# EAGLE design proxy (EAGLE 4.13)
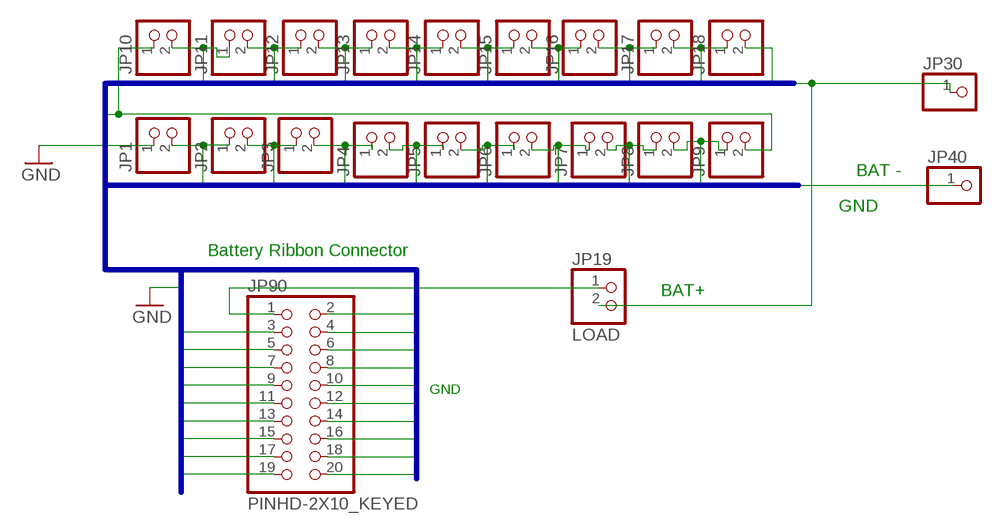
[diagram p0: schematic, sheet 1]

## Parts
JP1  PINHD-1X2  [1X02]
JP2  PINHD-1X2  [1X02]
JP3  PINHD-1X2  [1X02]
JP4  PINHD-1X2  [1X02]
JP5  PINHD-1X2  [1X02]
JP6  PINHD-1X2  [1X02]
JP7  PINHD-1X2  [1X02]
JP8  PINHD-1X2  [1X02]
JP9  PINHD-1X2  [1X02]
JP10  PINHD-1X2  [1X02]
JP11  PINHD-1X2  [1X02]
JP12  PINHD-1X2  [1X02]
JP13  PINHD-1X2  [1X02]
JP14  PINHD-1X2  [1X02]
JP15  PINHD-1X2  [1X02]
JP16  PINHD-1X2  [1X02]
JP17  PINHD-1X2  [1X02]
JP18  PINHD-1X2  [1X02]
JP19  LOAD  PINHD-1X2  [1X02]
JP30  PINHD-1X1  [1X01]
JP40  PINHD-1X1  [1X01]
JP90  PINHD-2X10_KEYED  [2X10_KEYED]

## Nets
CH1: JP1.2 JP2.1 JP90.12
CH2: JP2.2 JP3.1 JP90.3
CH3: JP3.2 JP4.1 JP90.13
CH4: JP4.2 JP5.1 JP90.4
CH5: JP5.2 JP6.1 JP90.14
CH6: JP6.2 JP7.1 JP90.5
CH7: JP7.2 JP8.1 JP90.15
CH8: JP8.2 JP9.1 JP90.6
CH9: JP9.2 JP10.1 JP90.16
CH10: JP10.2 JP11.1 JP90.7
CH11: JP11.2 JP12.1 JP90.17
CH12: JP12.2 JP13.1 JP90.8
CH13: JP13.2 JP14.1 JP90.18
CH14: JP14.2 JP15.1 JP90.9
CH15: JP15.2 JP16.1 JP90.19
CH16: JP16.2 JP17.1 JP90.10
CH17: JP17.2 JP18.1 JP90.20
CH18: JP18.2 JP19.2 JP30.1 JP90.11
CUR-SENSE: JP19.1 JP90.1
GND: JP1.1 JP40.1 JP90.2

## Buses
HDR$:GND,CH[0..18]

## Notes on the sheet
- BAT -
- GND
- Battery Ribbon Connector
- BAT+
- GND

## Library data of the parts
JP1-JP19 = pinhead:PINHD-1X2: PIN HEADER
JP30 JP40 = pinhead:PINHD-1X1: PIN HEADER
JP90 = pinhead:PINHD-2X10_KEYED

## Board
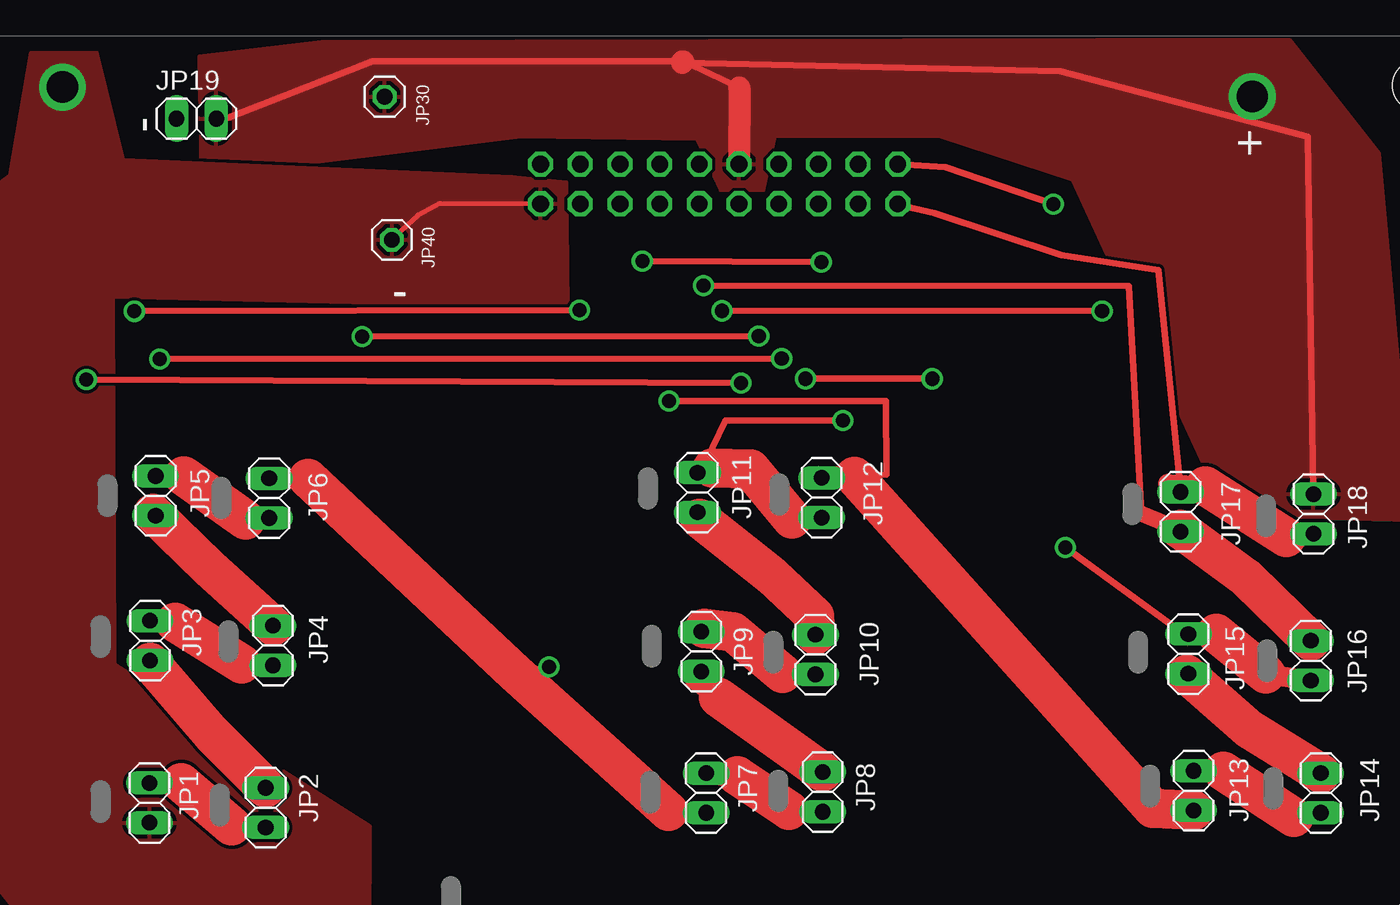
[diagram p1: board, top side]
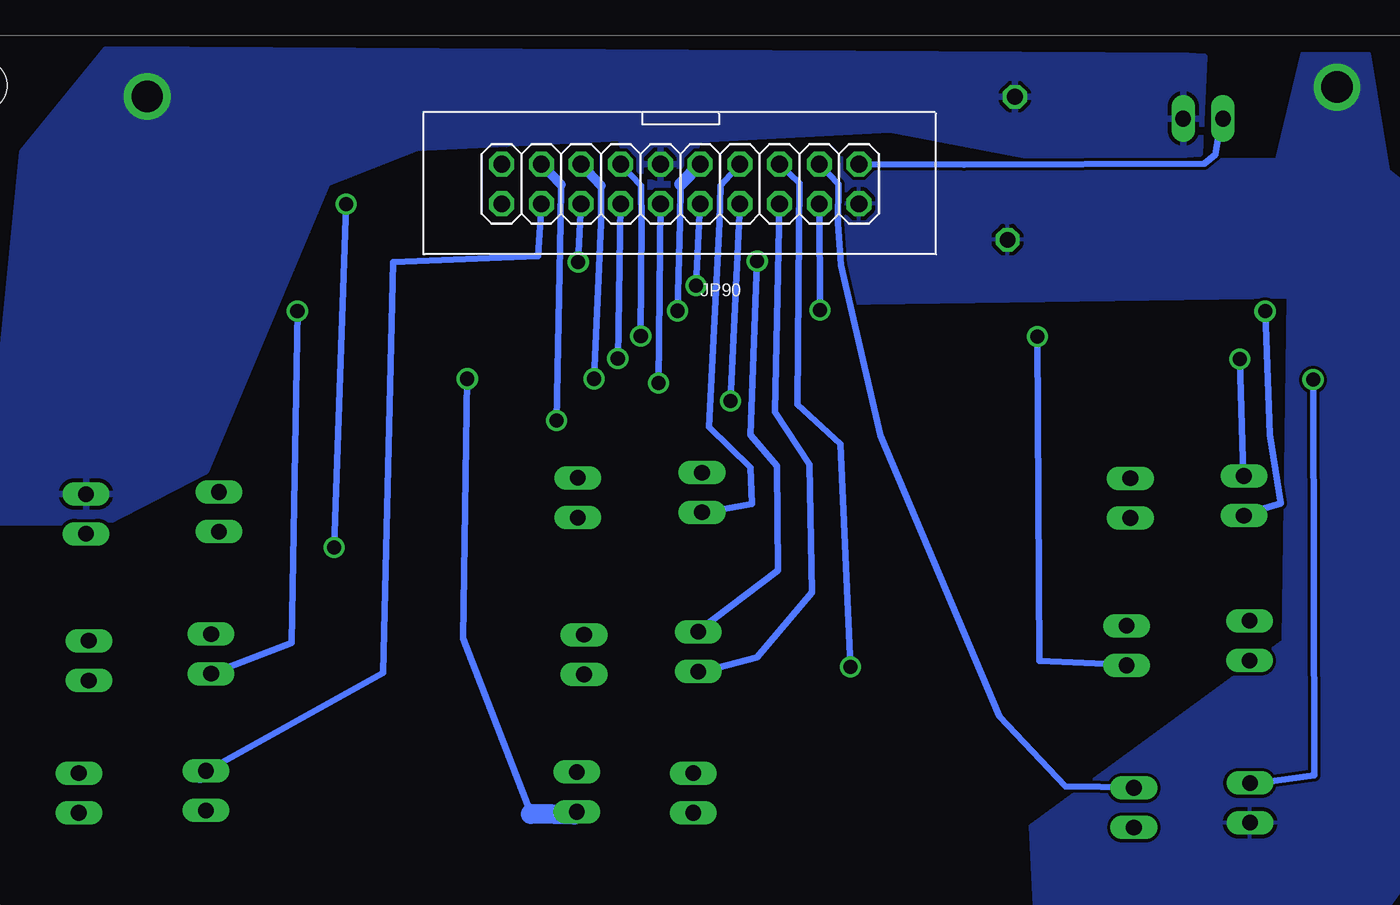
[diagram p2: board, bottom side, seen from below]

No outline drawn. Coordinates in mm, seen from the top.
Copper layers (1*16): Top 0.035mm / dielectric 1.5mm / Bottom 0.035mm
Design rules "default": minimum track width 8mil, minimum drill 0.6mm, track to track 8mil, track to pad 8mil, pad to pad 8mil, via to via 8mil, smd to smd 0mil, copper to edge 8mil, drill to drill 8mil, minimum pad ring 10mil, minimum via ring 8mil, stop-mask expansion 4mil, vias tented up to drill 0mil, thermal gap 10mil
Holes 3.2 mm at 3.2,3.2 3.2,56.8 96.8,56.8 96.8,3.2

### Footprints (pad centres in the part's own frame; a part is rotated, then mirrored left to right if it is on the bottom)
1X02 = drill 1 long: 1 -1.27,0; 2 1.27,0
1X01 = drill 1 octagon: 1 0,0
2X10_KEYED = drill 1.067 octagon: 1 -11.46,-1.27; 2 -11.46,1.27; 3 -8.92,-1.27; 4 -8.92,1.27; 5 -6.38,-1.27; 6 -6.38,1.27; 7 -3.84,-1.27; 8 -3.84,1.27; 9 -1.3,-1.27; 10 -1.3,1.27; 11 1.24,-1.27; 12 1.24,1.27; 13 3.78,-1.27; 14 3.78,1.27; 15 6.32,-1.27; 16 6.32,1.27; 17 8.86,-1.27; 18 8.86,1.27; 19 11.4,-1.27; 20 11.4,1.27

### Placement (x,y rotation side)
JP1  15.68,10.89 90 top
JP2  23.11,10.58 90 top
JP3  15.71,21.27 90 top
JP4  23.58,20.96 90 top
JP5  16.07,30.54 90 top
JP6  23.33,30.39 90 top
JP7  51.29,11.52 90 top
JP8  58.75,11.59 90 top
JP9  50.99,20.57 90 top
JP10  58.29,20.38 90 top
JP11  50.74,30.75 90 top
JP12  58.69,30.42 90 top
JP13  82.49,11.67 90 top
JP14  90.62,11.52 90 top
JP15  82.15,20.42 90 top
JP16  89.98,19.99 90 top
JP17  81.66,29.52 90 top
JP18  90.15,29.38 90 top
JP19  18.68,54.68 0 top
JP30  30.72,56.08 180 top
JP40  31.19,46.93 180 top
JP90  52.16,50.5 180 bottom

### Tracks (layer width: path | path; a pad name or v marks a point on that pad's centre or on a via)
CH1  (via drill 0.9)
  Top 0.406: v11.64,37.98 v53.53,37.77
  Top 0.813: JP1.2 15.66,12.13
  Top 1.27: 20.94,9.42 JP2.1 | 15.66,12.13 17.71,12.18
  Top 2.54: 17.71,12.18 20.94,9.42
  Bottom 0.406: v53.53,37.77 JP90.12 | v11.64,37.98 11.57,12.64 15.76,12.08 JP1.2
CH2
  Top 0.813: JP3.1 15.71,19.87
  Top 2.54: JP2.2 19.67,15.3 15.71,19.87
  Bottom 0.406: JP90.3 42.01,50.49 42.04,47.99 41.84,45.32 39.33,34.4 31.71,16.43 27.5,11.95 23.01,11.88 JP2.2
CH3  (via drill 0.9)
  Top 0.406: v29.28,40.72 v54.66,40.76
  Top 0.813: JP3.2 15.48,22.44
  Top 1.27: 21.56,19.79 JP4.1 | 15.48,22.44 17.32,22.43
  Top 2.54: 17.32,22.43 21.56,19.79
  Bottom 0.406: JP90.13 54.64,50.4 54.61,47.94 v54.66,40.76 | v29.28,40.72 29.15,19.99 23.46,19.73 JP4.1
CH4  (via drill 0.9)
  Top 0.406: v14.71,42.35 v43.2,42.42
  Top 0.813: JP5.1 15.92,29.42
  Top 2.54: JP4.2 19.54,25.88 15.92,29.42
  Bottom 0.406: v43.2,42.42 JP90.4 | v14.71,42.35 14.4,34.47 13.72,30.04 16.24,29.3 JP5.1
CH5  (via drill 0.9)
  Top 0.406: v16.34,39.29 v56.13,39.33
  Top 0.813: JP5.2 15.73,31.86
  Top 1.27: 21.82,29.01 JP6.1 | 15.73,31.86 17.87,31.82
  Top 2.54: 17.87,31.82 21.82,29.01
  Bottom 0.406: v56.13,39.33 JP90.14 | JP5.2 16.12,31.77 v16.34,39.29
CH6  (via drill 0.9)
  Top 0.406: 39.06,19.2 39.01,19.15 v41.24,19.58
  Top 0.813: JP6.2 23.42,31.66
  Top 1.27: 48.89,10.36 JP7.1 | 23.42,31.66 25.82,31.65
  Top 2.54: 25.82,31.65 39.06,19.2 48.89,10.36
  Bottom 0.406: JP90.5 44.49,50.54 44.54,47.49 44.64,36.38 41.87,33.85 v41.24,19.58
CH7  (via drill 0.9)
  Top 0.406: v65.76,38.03 v57.64,38.03
  Top 0.813: 50.91,12.67 JP7.2
  Top 1.27: 56.58,10.42 JP8.1 | 50.91,12.67 53.3,12.61
  Top 2.54: 53.3,12.61 56.58,10.42
  Bottom 0.406: v57.64,38.03 57.2,47.99 57.19,50.4 | v65.76,38.03 66.03,21.42 61.68,10.18 | JP8.1 58.91,10.14
  Bottom 0.61: 57.19,50.4 JP90.15
  Bottom 1.27: 58.91,10.14 61.68,10.18
CH8
  Top 0.813: JP9.1 50.57,18.77
  Top 1.27: 50.57,18.77 52.08,17.64
  Top 2.54: 52.08,17.64 JP8.2
  Bottom 0.406: JP90.6 46.06,35.91 43.86,32.53 43.72,24.36 47.23,20.19 50.99,19.22 JP9.1
CH9  (via drill 0.9)
  Top 0.406: v47.21,45.56 v58.66,45.49
  Top 0.813: 56.19,19.19 JP10.1
  Top 1.016: JP9.2 51.19,22.05
  Top 2.54: 56.19,19.19 53.02,21.82 51.19,22.05
  Bottom 0.406: v58.66,45.49 JP90.16 | v47.21,45.56 47.63,34.43 45.93,32.44 45.88,25.77 51.02,21.87 JP9.2
CH10
  Top 0.813: JP11.1 50.88,29.08
  Top 2.54: JP10.2 58.21,22.86 55.51,25.4 50.88,29.08
  Bottom 0.406: JP90.7 49.57,50.4 49.63,48.03 50.29,34.95 47.64,32.35 47.54,30.02 50.76,29.44 JP11.1
CH11  (via drill 0.9)
  Top 0.406: v60.04,35.35 52.53,35.35 50.88,31.89 JP11.2
  Top 0.813: JP11.2 51.7,32.31
  Top 1.27: 56.78,29.07 JP12.1
  Top 2.54: 56.78,29.07 54.13,32.27 51.7,32.31
  Bottom 0.406: 59.75,50.45 59.8,48.06 v60.04,35.35
  Bottom 0.61: 59.75,50.45 JP90.17
CH12  (via drill 0.9)
  Top 0.406: v48.92,36.6 62.81,36.6 62.83,31.92 60.78,31.79
  Top 0.813: 58.48,31.8 JP12.2
  Top 1.27: 60.78,31.79 58.48,31.8
  Top 2.54: JP13.1 79.87,10.53 60.78,31.79
  Bottom 0.406: v48.92,36.6 JP90.8
CH13
  Top 0.813: JP13.2 82.54,12.84
  Top 1.27: 88.89,9.97 JP14.1 | 82.54,12.84 84.38,12.92
  Top 2.54: 84.38,12.92 88.89,9.97
  Bottom 0.406: JP90.18 61.23,45.88 70.51,45.51 71.16,19.21 82.87,12.67
  Bottom 1.016: 82.87,12.67 JP13.2
CH14  (via drill 0.9)
  Top 0.406: v52.32,42.38 v76.63,42.37
  Top 0.813: JP15.1 82.05,19.1
  Top 2.54: JP14.2 86.01,15.63 82.05,19.1
  Bottom 0.406: 52.13,50.49 52.15,48.04 v52.32,42.38 | v76.63,42.37 77,21.12 82.08,19.18 JP15.1
  Bottom 0.813: 52.13,50.49 JP90.9
CH15  (via drill 0.9)
  Top 0.406: v73.51,49.22 66.62,51.57 JP90.19 | v74.27,27.23 82.13,21.5
  Top 0.813: JP15.2 82.01,21.59
  Top 1.016: 82.13,21.5 JP15.2
  Top 1.27: 87.12,19.16 JP16.1 | 82.01,21.59 83.95,21.72
  Top 2.54: 83.95,21.72 87.12,19.16
  Bottom 0.406: v74.27,27.23 v73.51,49.22
CH16  (via drill 0.9)
  Top 0.406: v51.13,43.99 78.35,43.97 79.15,29.4
  Top 0.813: JP17.1 81.62,28.39
  Top 1.016: JP17.1 81.85,28.29 79.15,29.4
  Top 2.54: JP16.2 85.87,25.3 81.62,28.39
  Bottom 0.406: v51.13,43.99 JP90.10
CH17
  Top 0.406: JP17.2 80.23,44.98 74.04,45.95 65.89,48.62 63.53,49.19 JP90.20
  Top 0.813: 80.85,31.31 JP17.2
  Top 1.27: 88.42,27.87 JP18.1 | 80.85,31.31 83.24,31.17
  Top 2.54: 83.24,31.17 88.42,27.87
  Bottom 1.016: JP90.20 63.51,49.49
CH18  (via drill 2)
  Top 0.406: 49.84,58.35 53.42,56.66 | 49.75,58.35 29.96,58.35 19.97,54.45 | JP18.2 89.78,53.54 73.96,57.73 49.75,58.25
  Top 1.422: 53.42,56.66 JP90.11 | 49.84,58.35 49.75,58.35 49.75,58.25 | JP19.2 19.97,54.45
  other vias: 86.24,56.1
  pour Top (rank 3): 96.55,28.95 94.4,52.43 88.63,59.75 26.66,59.59 18.82,58.67 18.95,50.97 39.44,53.51 50.68,53.35 52.2,50.06 55,50.09 55.72,53.57 66.3,53.51 74.68,50.76 84.6,29.24
  pour Bottom: 19.64,58.72 88.85,59.11 94.25,52.53 96.59,28.84 88.82,28.84 82.5,32.1 74.73,50.54 69.04,52.8 55.93,53.43 55.21,50.09 52.68,49.91 50.87,53.34 38.67,53.98 27.29,51.81 18.89,52.44 18.59,58.64
CUR-SENSE
  Bottom 0.406: JP90.1 33.97,51.74 18.59,51.81 17.91,52.37 17.48,54.86
  Bottom 1.016: JP19.1 17.48,54.86
GND  (via drill 2)
  Top 0.305: JP90.2 34.28,49.26 32.85,48.52 31.09,46.89 JP40.1
  other vias: 10.11,56.7
  pour Bottom (rank 2): 6.83,51.39 1.75,47.28 1.69,11.28 8.42,1.96 29.38,2.34 29.73,9.41 13.55,21.27 13.24,43.23 42.21,42.82 41.76,52.23 13.95,52.09 12.33,58.91 8.05,58.88
  pour Top (rank 2): 6.73,51.06 8.09,58.94 12.3,58.95 13.99,52.09 38.86,51 40.07,50.87 42.36,50.66 42.46,42.57 13.36,43.23 13.44,19.8 29.8,9.41 29.77,1.95 9,1.61 1.25,11.19 1.78,47.47

### Text on the board
tNames: - | + | -
tDocu: - | KEY | 20230208 | BMS/hw/eagle/proxy
bDocu: + | cs | + | KEY | 1 | - | + | - | + | 5 | 6 | 11 | 12 | 17 | 18 | 3 | 4 | 9 | 10 | 15 | 16 | 1 | 7 | 8 | 13 | 14 | 2